# EAGLE design 408_jetracer_ledappend_board (EAGLE 9.6.2)
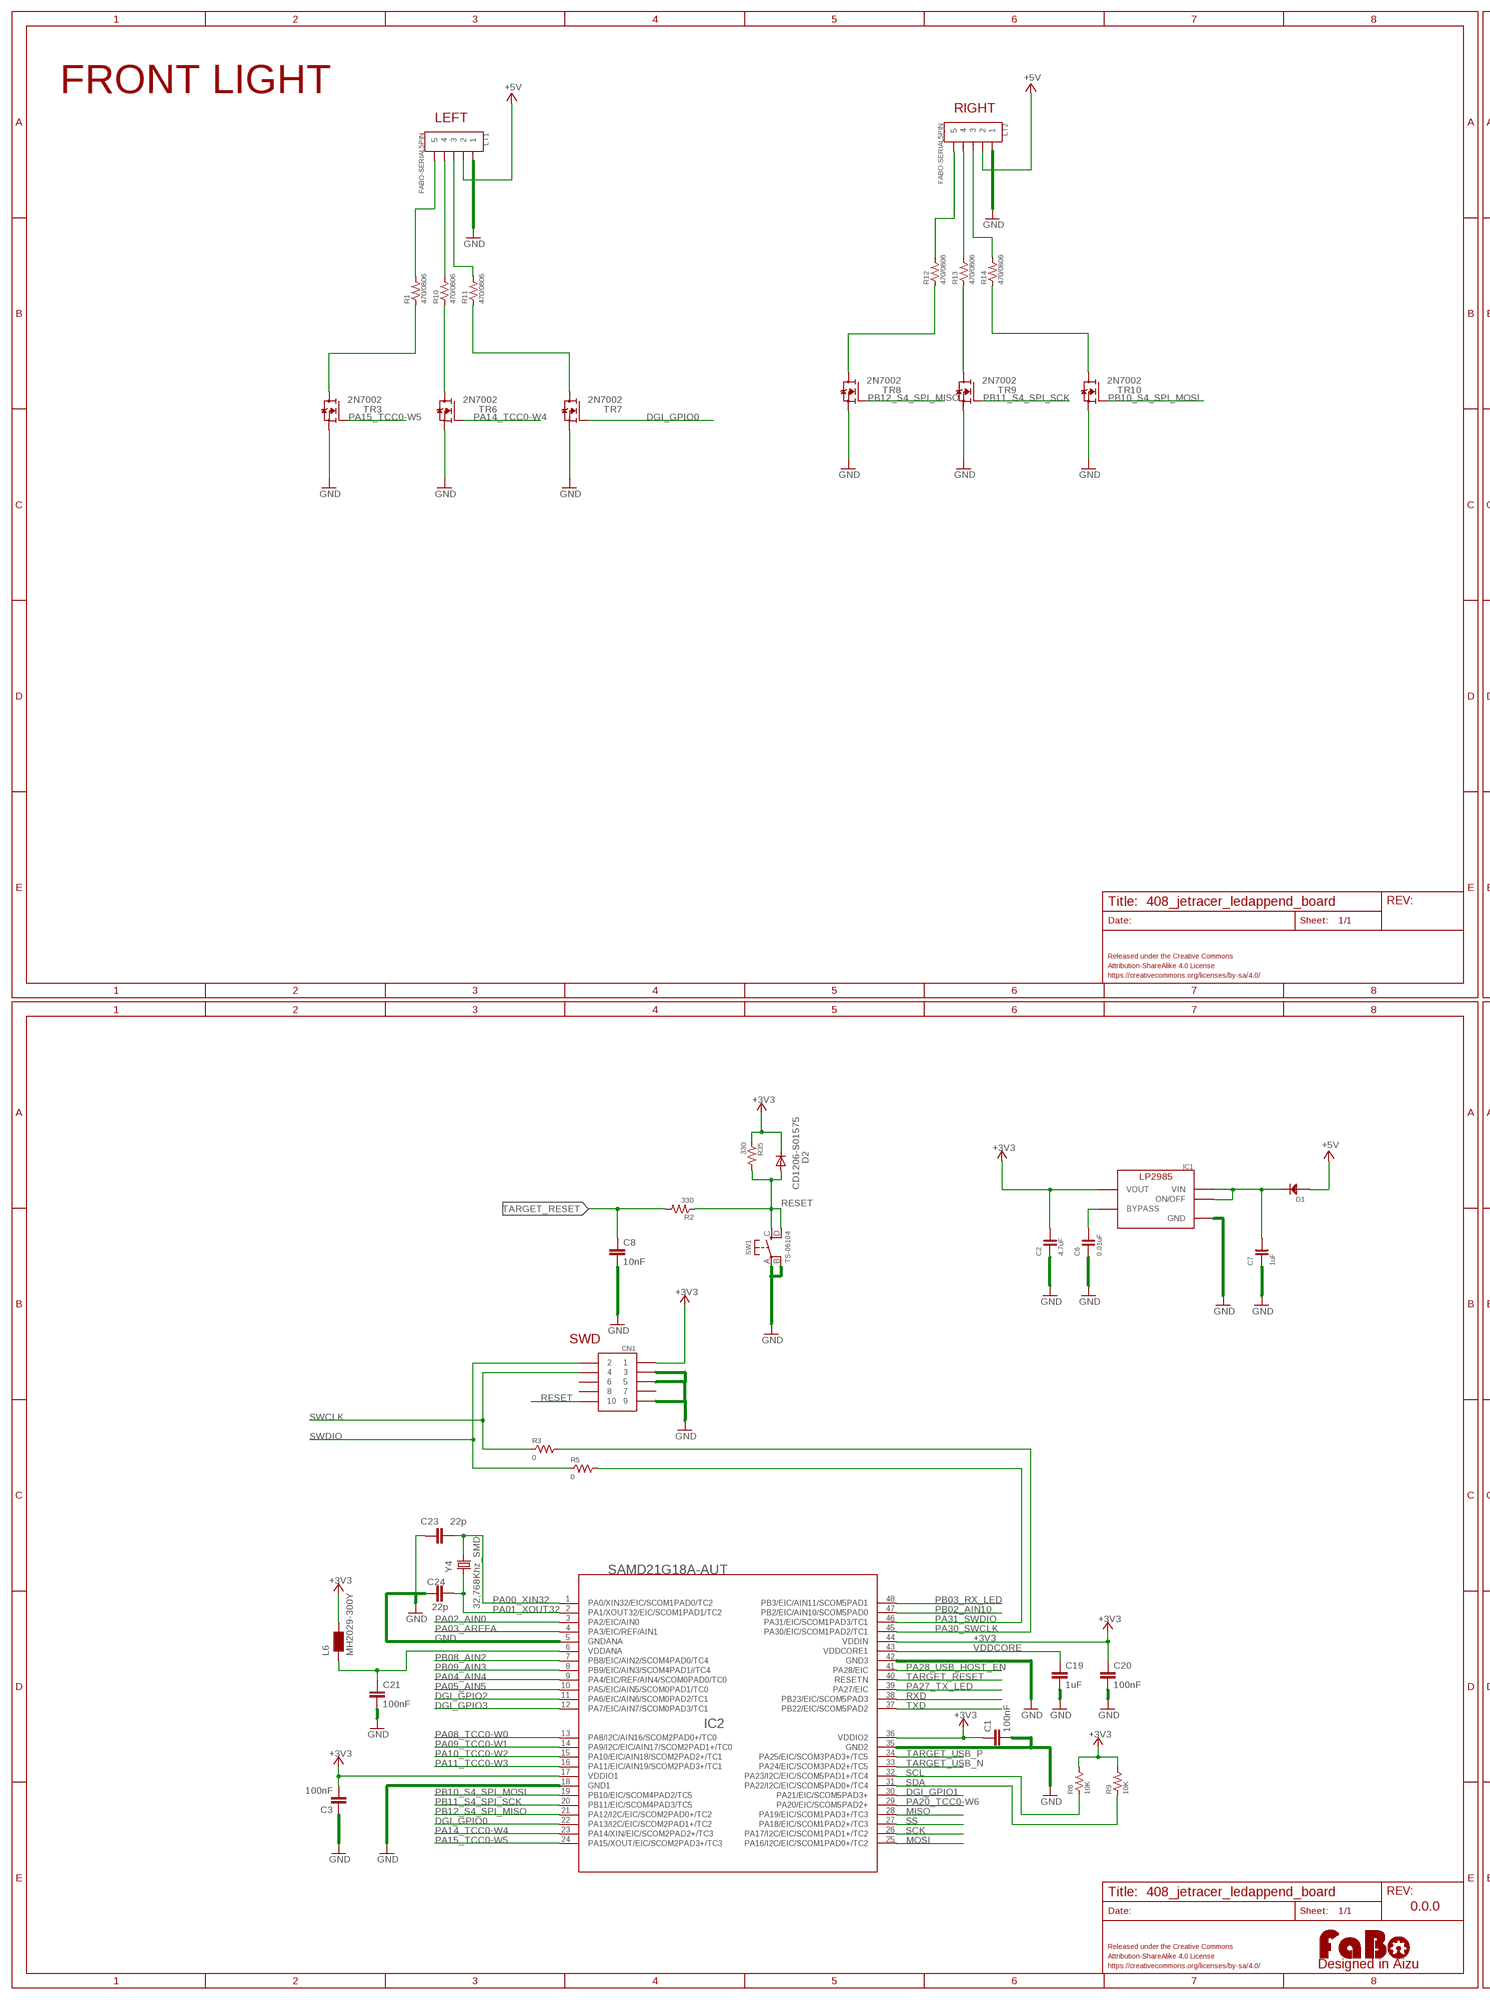
[diagram p0: schematic, sheet 1, part 1 of 2]
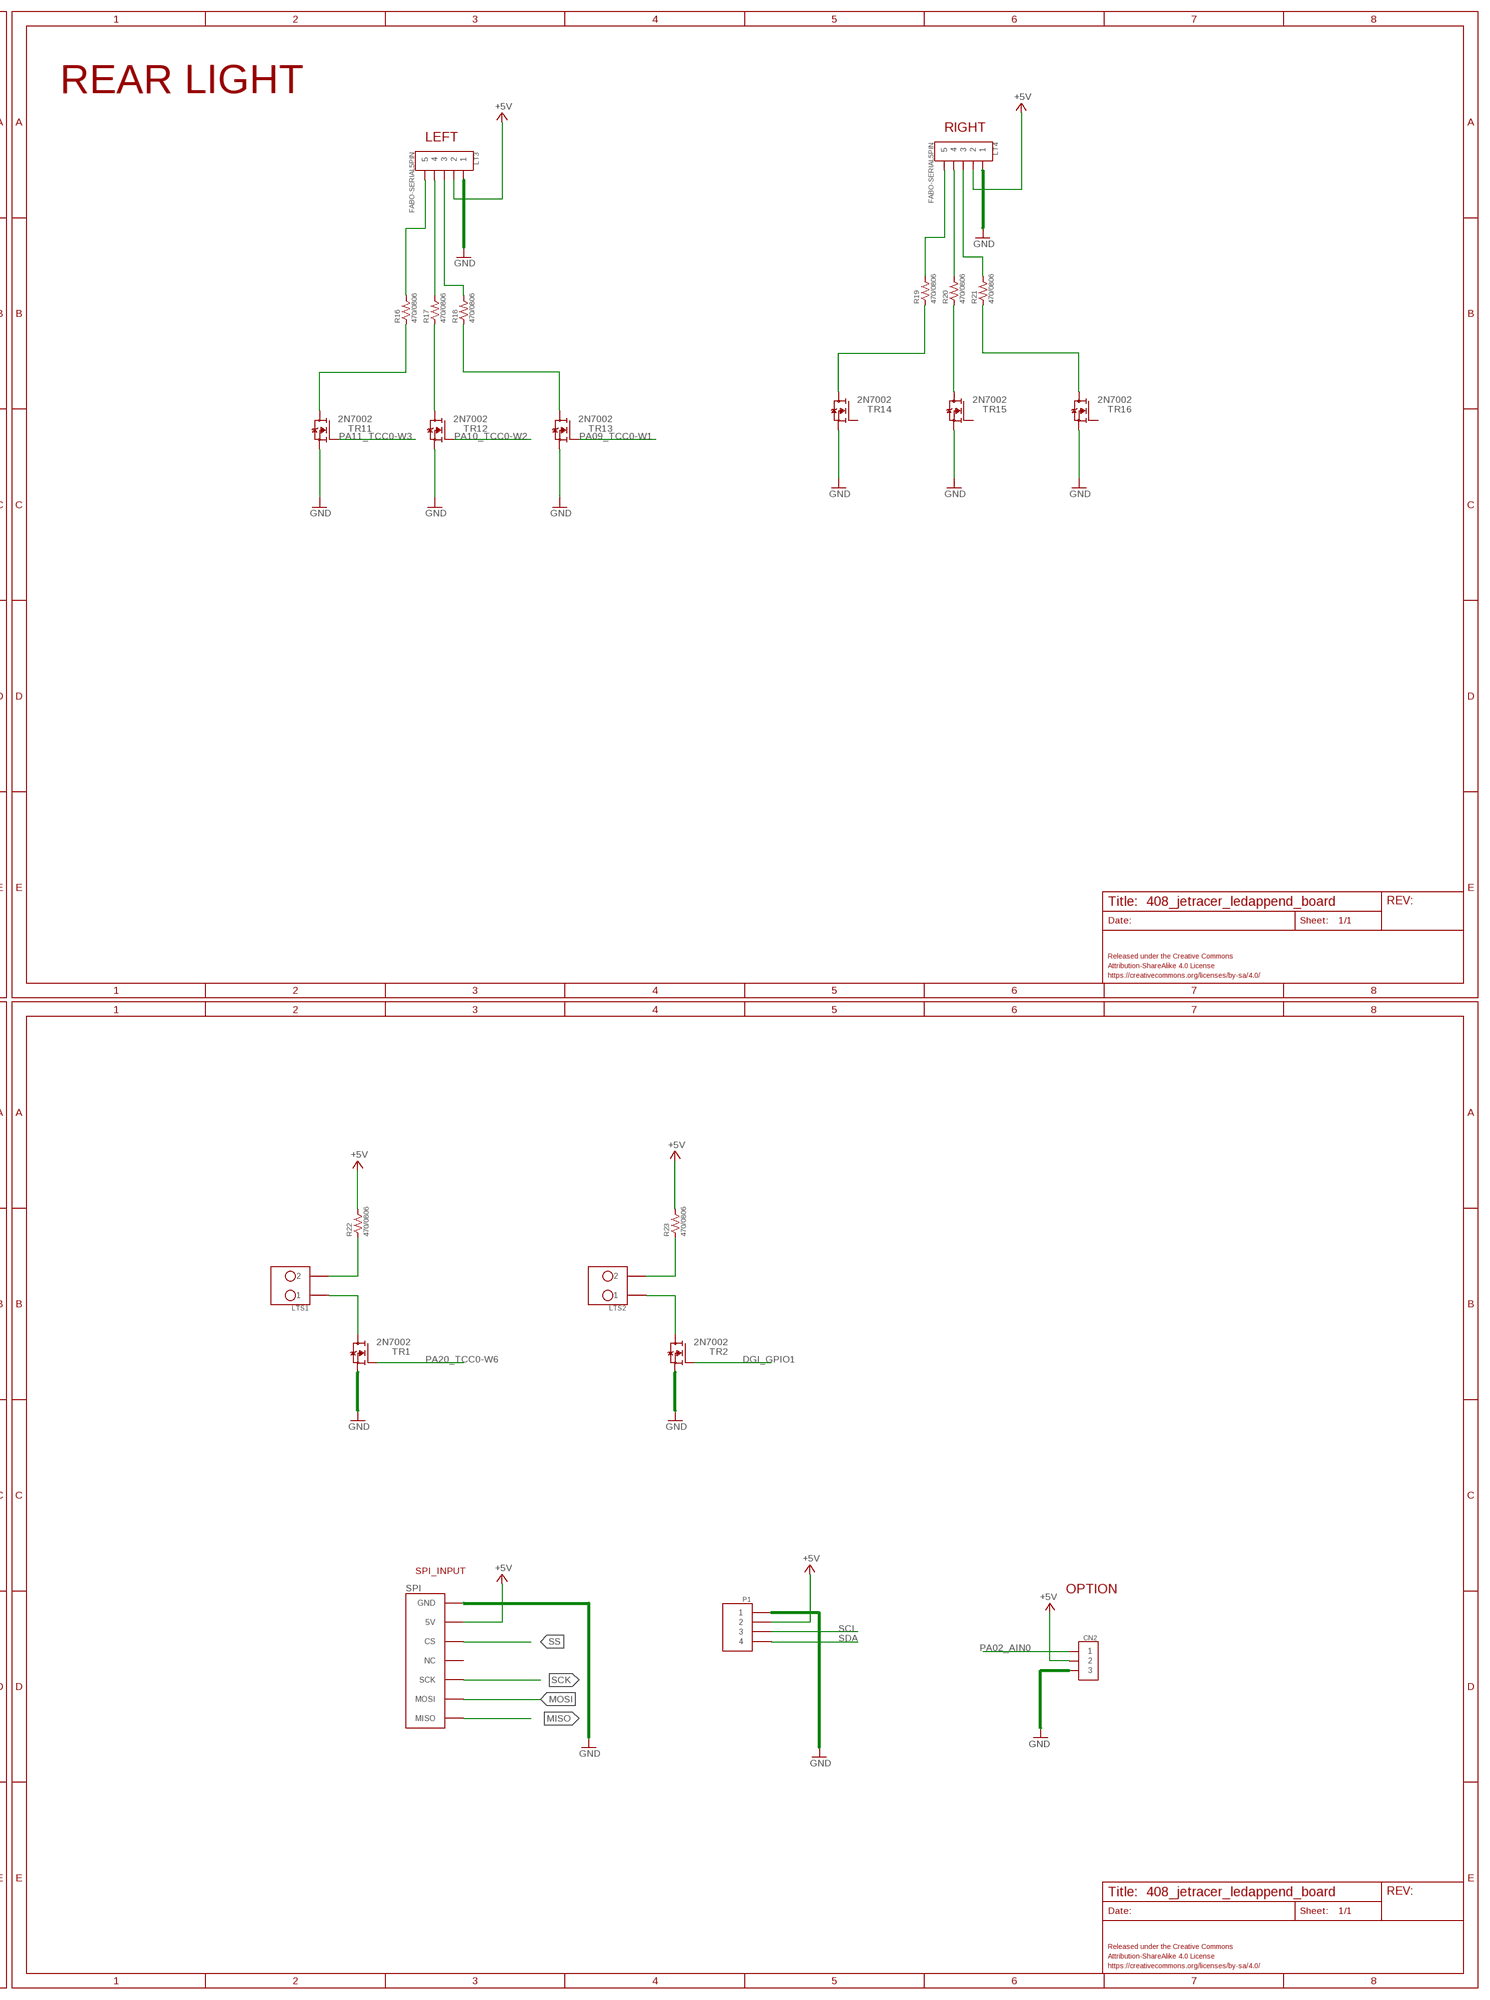
[diagram p1: schematic, sheet 1, part 2 of 2]

## Parts
C1  100nF  0015_100NF_0603  [C0603-ROUND]
C2  4.7uF  CAPACITOR-0603  [0603]
C3  100nF  0015_100NF_0603  [C0603-ROUND]
C6  0.01uF  CAPACITOR-0603  [0603]
C7  1uF  CAPACITOR-0603  [0603]
C8  10nF  0142_10NF_0603  [C0603-ROUND]
C19  1uF  0006_1UF_0603/GRM188R61E105KA12D  [C0603-ROUND]
C20  100nF  0015_100NF_0603  [C0603-ROUND]
C21  100nF  0015_100NF_0603  [C0603-ROUND]
C23  22p  0014_22PF_0603  [C0603-ROUND]
C24  22p  0014_22PF_0603  [C0603-ROUND]
CN1  PIN-HEADER-SMT(1.27MM)2X5  [PIN-HEADER-SMT(1.27MM)2X5]
CN2  PIN_1X3  [PIN_1X3]
D1  DIODE-SOD-323  [SOD-323]
D2  CD1206-S01575  0012_CD1206-S01575  [MINIMELF]
IC1  LP2985-33DBV  [SOT-23-5]
IC2  SAMD21G18A-AUT  1792_SAMD21G18A-AUT  [TQFP48-7X7]
L6  MH2029-300Y  0001_BLM21PG300SN1D_/_MH2029-300Y  [0805]
LOGO2  LOGO_FABO-M_BOTTOM  [LOGO_FABO_M_BOTTOM]
LT1  FABO-SERIAL5PIN  [BM05B-PASS-1]
LT2  FABO-SERIAL5PIN  [BM05B-PASS-1]
LT3  FABO-SERIAL5PIN  [BM05B-PASS-1]
LT4  FABO-SERIAL5PIN  [BM05B-PASS-1]
LTS1  B2B-XH-AM  [B2B-XH-AM]
LTS2  B2B-XH-AM  [B2B-XH-AM]
P1  4PIN_HEADER_1.25MM  [4PIN_1.25MM]
R1  470/0806  RESISTOR-0805  [0805]
R2  330  RESISTOR-0603  [0603]
R3  0  RESISTOR-0603  [0603]
R5  0  RESISTOR-0603  [0603]
R8  10K  RESISTOR-0603  [0603]
R9  10K  RESISTOR-0603  [0603]
R10  470/0806  RESISTOR-0805  [0805]
R11  470/0806  RESISTOR-0805  [0805]
R12  470/0806  RESISTOR-0805  [0805]
R13  470/0806  RESISTOR-0805  [0805]
R14  470/0806  RESISTOR-0805  [0805]
R16  470/0806  RESISTOR-0805  [0805]
R17  470/0806  RESISTOR-0805  [0805]
R18  470/0806  RESISTOR-0805  [0805]
R19  470/0806  RESISTOR-0805  [0805]
R20  470/0806  RESISTOR-0805  [0805]
R21  470/0806  RESISTOR-0805  [0805]
R22  470/0806  RESISTOR-0805  [0805]
R23  470/0806  RESISTOR-0805  [0805]
R35  330  RESISTOR-0603  [0603]
SPI  FABO-7PINMULTI_SPI  [BM07B-PASS-1]
SW1  TS-06104  [TS-06104]
TR1  2N7002  1612_2N7002LT1G  [SOT-23]
TR2  2N7002  1612_2N7002LT1G  [SOT-23]
TR3  2N7002  1612_2N7002LT1G  [SOT-23]
TR6  2N7002  1612_2N7002LT1G  [SOT-23]
TR7  2N7002  1612_2N7002LT1G  [SOT-23]
TR8  2N7002  1612_2N7002LT1G  [SOT-23]
TR9  2N7002  1612_2N7002LT1G  [SOT-23]
TR10  2N7002  1612_2N7002LT1G  [SOT-23]
TR11  2N7002  1612_2N7002LT1G  [SOT-23]
TR12  2N7002  1612_2N7002LT1G  [SOT-23]
TR13  2N7002  1612_2N7002LT1G  [SOT-23]
TR14  2N7002  1612_2N7002LT1G  [SOT-23]
TR15  2N7002  1612_2N7002LT1G  [SOT-23]
TR16  2N7002  1612_2N7002LT1G  [SOT-23]
Y4  32,768Khz_SMD  0213_ABS07-32.768KHZ-T  [RESONATOR_EPSON_FC_145]

## Nets
+3V3: C1.1 C2.2 C3.2 C20.1 CN1.1 D2.C IC1.5(VOUT) IC2.17(VDDIO1) IC2.36(VDDIO2) IC2.44(VDDIN) L6.2 R8.2 R9.2 R35.1
+5V [usbvcc]: CN2.2 D1.A(ANODE) LT1.2 LT2.2 LT3.2 LT4.2 P1.2 R22.2 R23.2 SPI.2(5V)
DGI_GPIO0: IC2.22(PA13/I2C/EIC/SCOM2PAD1+/TC2) TR7.3(G)
DGI_GPIO1: IC2.30(PA21/EIC/SCOM5PAD3+) TR2.3(G)
DGI_GPIO2: IC2.11(PA6/EIC/AIN6/SCOM0PAD2/TC1)
DGI_GPIO3: IC2.12(PA7/EIC/AIN7/SCOM0PAD3/TC1)
GND [gnd]: C1.2 C2.1 C3.1 C6.1 C7.1 C8.2 C19.2 C20.2 C21.2 C23.1 C24.1 CN1.3 CN1.5 CN1.9 CN2.3 IC1.2(GND) IC2.5(GNDANA) IC2.18(GND1) IC2.35(GND2) IC2.42(GND3) LT1.1 LT2.1 LT3.1 LT4.1 P1.1 SPI.1(GND) SW1.A SW1.B TR1.2(S) TR2.2(S) TR3.2(S) TR6.2(S) TR7.2(S) TR8.2(S) TR9.2(S) TR10.2(S) TR11.2(S) TR12.2(S) TR13.2(S) TR14.2(S) TR15.2(S) TR16.2(S)
MISO: IC2.28(PA19/EIC/SCOM1PAD3+/TC3) SPI.7(MISO)
MOSI: IC2.25(PA16/I2C/EIC/SCOM1PAD0+/TC2) SPI.6(MOSI)
N$1: R13.1 TR9.1(D)
N$2: R10.1 TR6.1(D)
N$3: R1.1 TR3.1(D)
N$5: R11.1 TR7.1(D)
N$6: LT1.5 R1.2
N$7: C6.2 IC1.4(BYPASS)
N$8: R12.1 TR8.1(D)
N$9: LT1.4 R10.2
N$10: C21.1 IC2.6(VDDANA) L6.1
N$11: LT1.3 R11.2
N$12: LT2.5 R12.2
N$13: LT2.4 R13.2
N$14: LT2.3 R14.2
N$15: R14.1 TR10.1(D)
N$16: R17.1 TR12.1(D)
N$17: R16.1 TR11.1(D)
N$18 [usbvcc]: LTS1.2 R22.1
N$19 [usbvcc]: LTS2.2 R23.1
N$20: LT3.5 R16.2
N$21: LT3.4 R17.2
N$22: LT3.3 R18.2
N$23: LT4.5 R19.2
N$24: LT4.4 R20.2
N$25: LT4.3 R21.2
N$26: R18.1 TR13.1(D)
N$27: R20.1 TR15.1(D)
N$28: R19.1 TR14.1(D)
N$31: R21.1 TR16.1(D)
N$32 [usbvcc]: C7.2 D1.K(CATHODE) IC1.1(VIN) IC1.3(ON/OFF)
N$33: LTS1.1 TR1.1(D)
N$34: LTS2.1 TR2.1(D)
PA00_XIN32: C23.2 IC2.1(PA0/XIN32/EIC/SCOM1PAD0/TC2) Y4.P$2
PA01_XOUT32: C24.2 IC2.2(PA1/XOUT32/EIC/SCOM1PAD1/TC2) Y4.P$1
PA02_AIN0: CN2.1 IC2.3(PA2/EIC/AIN0)
PA03_AREFA: IC2.4(PA3/EIC/REF/AIN1)
PA04_AIN4: IC2.9(PA4/EIC/REF/AIN4/SCOM0PAD0/TC0)
PA05_AIN5: IC2.10(PA5/EIC/AIN5/SCOM0PAD1/TC0)
PA08_TCC0-W0: IC2.13(PA8/I2C/AIN16/SCOM2PAD0+/TC0)
PA09_TCC0-W1: IC2.14(PA9/I2C/EIC/AIN17/SCOM2PAD1+/TC0) TR13.3(G)
PA10_TCC0-W2: IC2.15(PA10/EIC/AIN18/SCOM2PAD2+/TC1) TR12.3(G)
PA11_TCC0-W3: IC2.16(PA11/EIC/AIN19/SCOM2PAD3+/TC1) TR11.3(G)
PA14_TCC0-W4: IC2.23(PA14/XIN/EIC/SCOM2PAD2+/TC3) TR6.3(G)
PA15_TCC0-W5: IC2.24(PA15/XOUT/EIC/SCOM2PAD3+/TC3) TR3.3(G)
PA20_TCC0-W6: IC2.29(PA20/EIC/SCOM5PAD2+) TR1.3(G)
PA27_TX_LED: IC2.39(PA27/EIC)
PA28_USB_HOST_EN: IC2.41(PA28/EIC)
PA30_SWCLK: IC2.45(PA30/EIC/SCOM1PAD2/TC1) R3.2
PA31_SWDIO: IC2.46(PA31/EIC/SCOM1PAD3/TC1) R5.2
PB02_AIN10: IC2.47(PB2/EIC/AIN10/SCOM5PAD0)
PB03_RX_LED: IC2.48(PB3/EIC/AIN11/SCOM5PAD1)
PB08_AIN2: IC2.7(PB8/EIC/AIN2/SCOM4PAD0/TC4)
PB09_AIN3: IC2.8(PB9/EIC/AIN3/SCOM4PAD1//TC4)
PB10_S4_SPI_MOSI: IC2.19(PB10/EIC/SCOM4PAD2/TC5) TR10.3(G)
PB11_S4_SPI_SCK: IC2.20(PB11/EIC/SCOM4PAD3/TC5) TR9.3(G)
PB12_S4_SPI_MISO: IC2.21(PA12/I2C/EIC/SCOM2PAD0+/TC2) TR8.3(G)
RESET: CN1.10 D2.A R2.1 R35.2 SW1.C SW1.D
RXD: IC2.38(PB23/EIC/SCOM5PAD3)
SCK: IC2.26(PA17/I2C/EIC/SCOM1PAD1+/TC2) SPI.5(SCK)
SCL: IC2.32(PA23/I2C/EIC/SCOM5PAD1+/TC4) P1.3 R8.1
SDA: IC2.31(PA22/I2C/EIC/SCOM5PAD0+/TC4) P1.4 R9.1
SS: IC2.27(PA18/EIC/SCOM1PAD2+/TC3) SPI.3(CS)
SWCLK: CN1.4 R3.1
SWDIO: CN1.2 R5.1
TARGET_RESET: C8.1 IC2.40(RESETN) R2.2
TARGET_USB_N [USBpair]: IC2.33(PA24/EIC/SCOM3PAD2+/TC5)
TARGET_USB_P [USBpair]: IC2.34(PA25/EIC/SCOM3PAD3+/TC5)
TXD: IC2.37(PB22/EIC/SCOM5PAD2)
VDDCORE: C19.1 IC2.43(VDDCORE1)
Unconnected: CN1.6 CN1.7 CN1.8 SPI.4(NC) TR14.3(G) TR15.3(G) TR16.3(G)

## Notes on the sheet
- FRONT LIGHT | REAR LIGHT
- RIGHT
- LEFT
- RIGHT
- LEFT
- SWD
- SPI_INPUT
- OPTION
- 0.0.0

## Library data of the parts
C1 C3 C20 C21 = Condensatori:0015_100NF_0603: 100nF 0603 50V; CASE: 0603; MONTHLY_USAGE: _____; PART_NUMBER: cl10b104kbnc; PRICE: _____; SUPPLIER: _____; TYPE: Condensatori
C2 C6 C7 = FaBo-Capacitor:CAPACITOR: CAPACITOR
C8 = Condensatori:0142_10NF_0603: 10nF 0603; CASE: 0603; MONTHLY_USAGE: _____; PART_NUMBER: 10nF_0603; PRICE: _____; SUPPLIER: _____; TYPE: Condensatori
C19 = Condensatori:0006_1UF_0603/GRM188R61E105KA12D: 1uF 0603; CASE: 0603; MONTHLY_USAGE: _____; PART_NUMBER: 1uF_0603/GRM188R61E105KA12D; PRICE: _____; SUPPLIER: _____; TYPE: Condensatori
C23 C24 = Condensatori:0014_22PF_0603: 22pF 0603; CASE: 0603; MONTHLY_USAGE: _____; PART_NUMBER: 22pF_0603; PRICE: _____; SUPPLIER: _____; TYPE: Condensatori
CN1 = FaBo-PIN:PIN-HEADER-SMT(1.27MM)2X5
CN2 = FaBo-PIN:PIN_1X3
D1 = FaBo-Diode:DIODE
D2 = Diodi:0012_CD1206-S01575: small-signal high-speed Switching Diodes CD1206; CASE: 1206; MONTHLY_USAGE: _____; PART_NUMBER: CD1206-S01575; PRICE: _____; SUPPLIER: _____; TYPE: Diodi
IC1 = FaBo-Supply:LP2985: LP2985
IC2 = IntegratedCircuits:1792_SAMD21G18A-AUT: Atmel D21 32bit ARM Cortex-M0 microcontroller - 48 PIN TQFP 256KB flash memory + 32KB SRAM
L6 = Protezione:0001_BLM21PG300SN1D_/_MH2029-300Y: BLM21; MONTHLY_USAGE: _____; PART_NUMBER: BLM21PG300SN1D_/_MH2029-300Y; PRICE: _____; SUPPLIER: _____; TYPE: Protezione
LOGO2 = FaBo-Logo:LOGO_FABO
LT1-LT4 = FaBo-Connetor:FABO-SERIAL5PIN
LTS1 LTS2 = FaBo-Connetor:B2B-XH-AM
P1 = FaBo-Connetor:4PIN_HEADER_1.25MM
R1-R3 R5 R8-R14 R16-R23 R35 = FaBo-Resistors:RESISTOR: RESISTOR
SPI = FaBo-Connetor:FABO-7PINMULTI_SPI
SW1 = FaBo-Switch:TS-06104
TR1-TR3 TR6-TR16 = Transistors:1612_2N7002LT1G: 2N7002 60 V, 300 mA N-channel Trench MOSFET
Y4 = Cristalli:0213_ABS07-32.768KHZ-T: 32,768KHz - SMD; MONTHLY_USAGE: _____; PART_NUMBER: ABS07-32.768KHZ-T; PRICE: _____; SUPPLIER: _____; TYPE: Cristalli

## Net classes
0 default: width 0.203 mm, drill 0.406 mm, clearance 0.203 mm
1 USB: width 0.203 mm, drill 0.305 mm, clearance 0.178 mm
2 gnd: width 0.254 mm, drill 0.254 mm, clearance 0.178 mm
3 usbvcc: width 0.203 mm, drill 0.406 mm, clearance 0.178 mm
4 USBpair: width 0.254 mm, drill 0.406 mm, clearance 0.406 mm

## Board
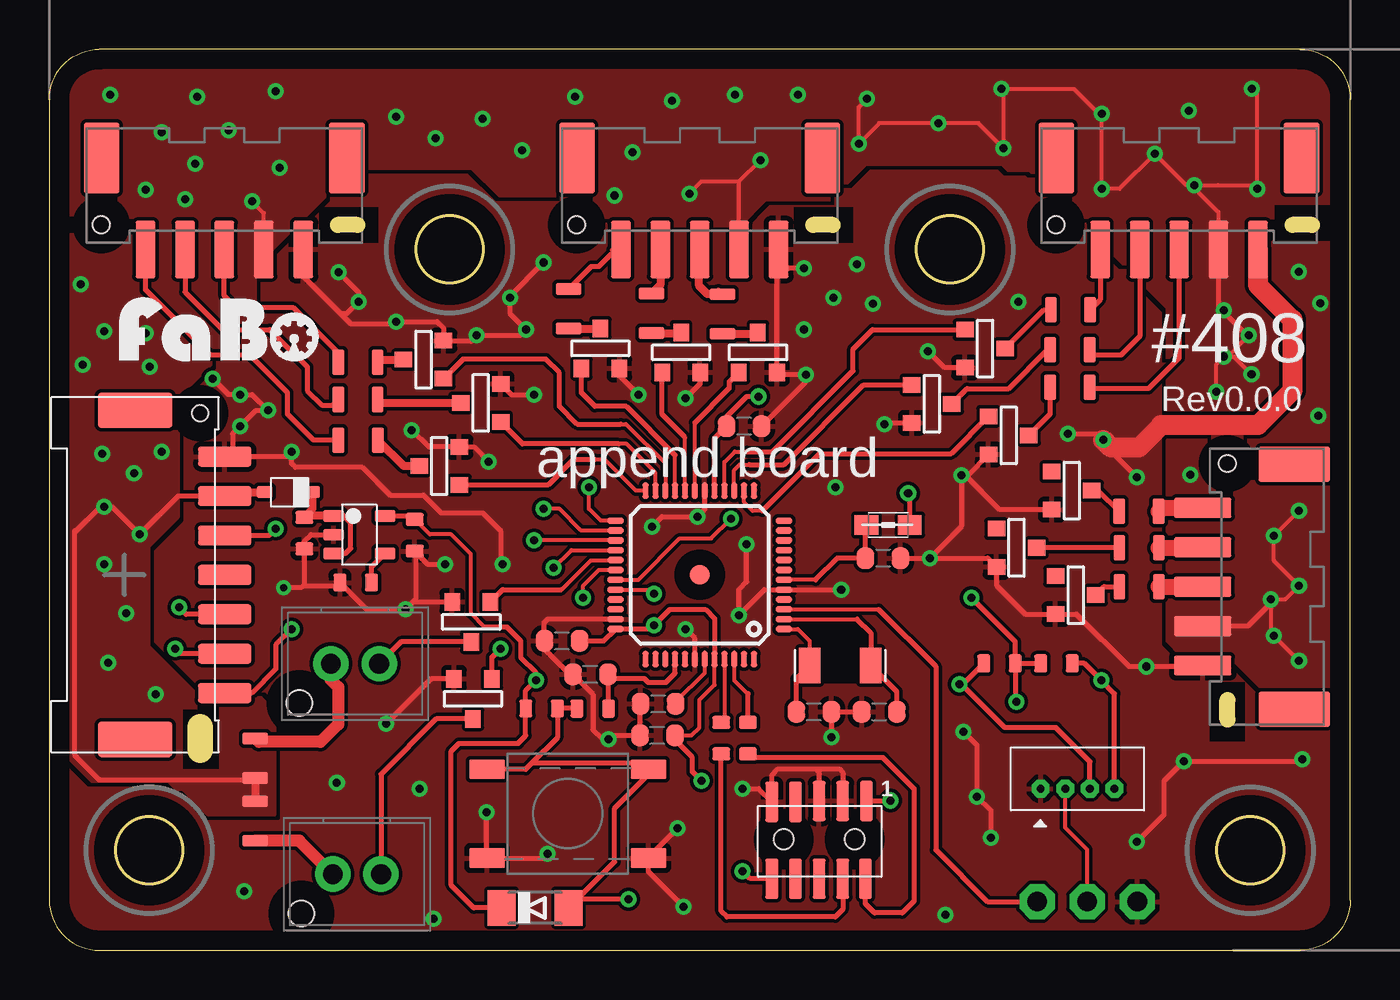
[diagram p2: board, top side]
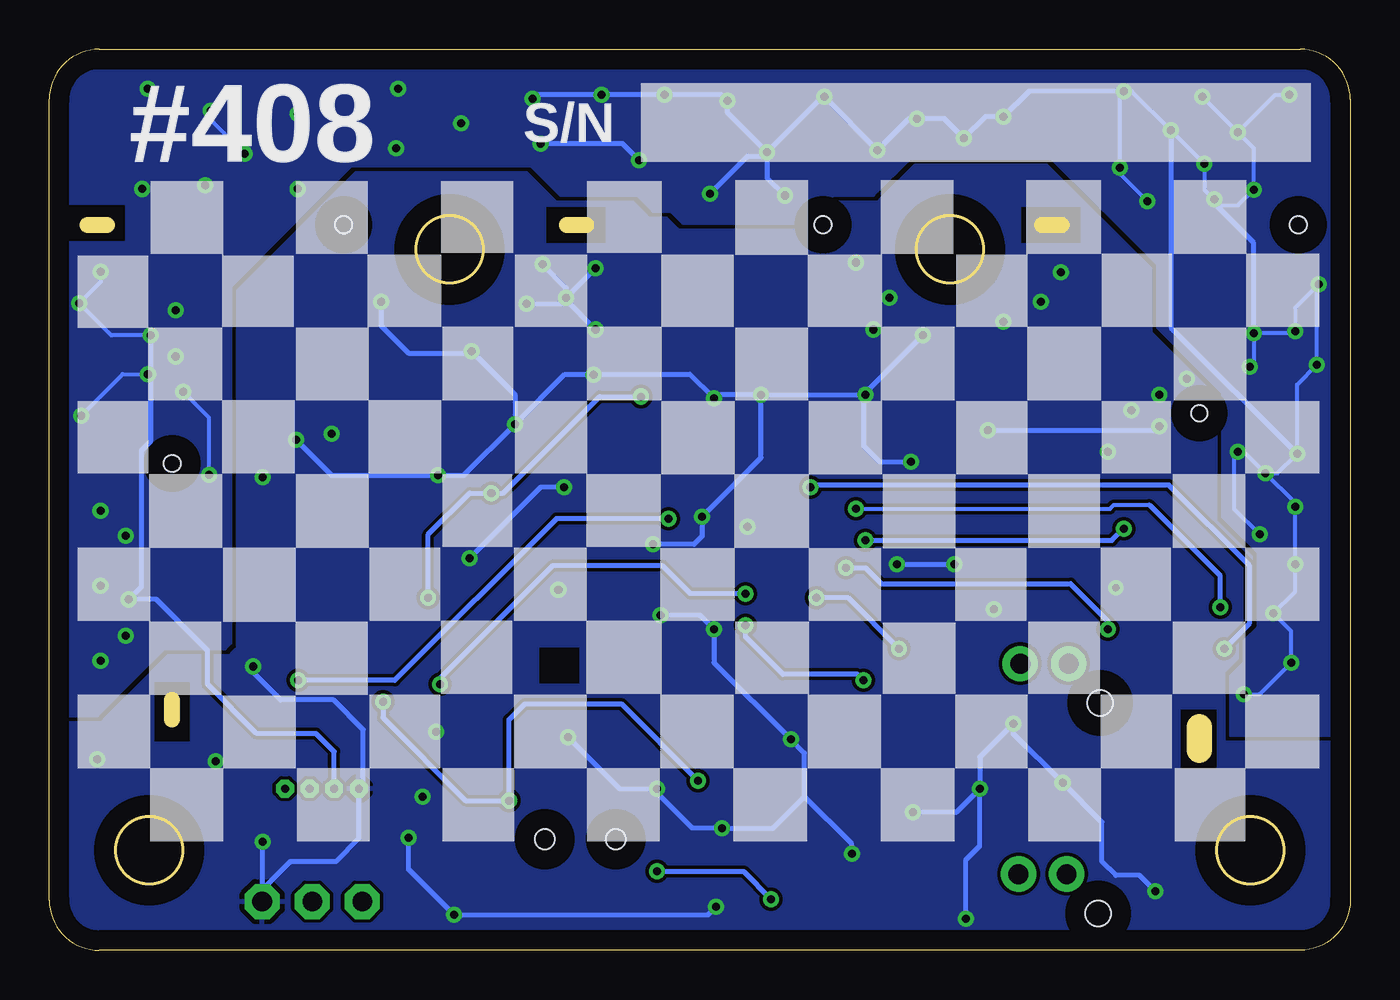
[diagram p3: board, bottom side, seen from below]

Size 66.04 x 45.72 mm. Coordinates in mm from the lower left corner, seen from the top.
Outline: 2.54,0 63.5,0 arc90 66.04,2.54 66.04,43.18 arc90 63.5,45.72 2.54,45.72 arc90 0,43.18 0,2.54 arc90 2.54,0
Outline: circle at 5.08,5.08 radius 1.7
Outline: circle at 20.32,35.56 radius 1.7
Outline: circle at 60.96,5.08 radius 1.7
Outline: circle at 45.72,35.56 radius 1.7
Copper layers (1*16): Top 0.035mm / dielectric 1.5mm / Bottom 0.035mm
Design rules "default *": minimum track width 6mil, minimum drill 0.35mm, track to track 6mil, track to pad 6mil, pad to pad 6mil, via to via 6mil, smd to smd 6mil, copper to edge 40mil, drill to drill 6mil, minimum pad ring 10mil, minimum via ring 8mil, stop-mask expansion 4mil, vias tented up to drill 0.6mm, thermal gap 10mil
tRestrict: area 6.8,9.2 to 8.6,12.2; area 58.9,10.6 to 60.7,13.6; area 62.2,36 to 65.2,37.8; area 37.8,35.9 to 40.8,37.7; area 13.7,35.9 to 16.7,37.7
bRestrict: area 6.8,9.2 to 8.6,12.2; area 58.9,10.6 to 60.7,13.6; area 13.7,35.9 to 16.7,37.7; area 37.8,35.9 to 40.8,37.7; area 62.2,36 to 65.2,37.8

### Footprints (pad centres in the part's own frame; a part is rotated, then mirrored left to right if it is on the bottom)
C0603-ROUND = smd 0.898 x 1.1: 1 -0.889,0; 2 0.889,0
0603 = smd 0.65 x 0.9: 1 -0.8,0; 2 0.8,0
PIN-HEADER-SMT(1.27MM)2X5 = smd 0.635 x 2.032: 1 -2.4,-1.95; 2 -2.35,2; 3 -1.2,-1.95; 4 -1.2,2; 5 0,-1.95; 6 0,2; 7 1.2,-1.9; 8 1.2,2; 9 2.4,-1.9; 10 2.4,2 | hole 1: 1.8,0; -1.8,0
PIN_1X3 = drill 1 pad 1.778 octagon: 1 -2.54,0; 2 0,0; 3 2.54,0
SOD-323 = smd 0.8 x 0.6: A -1.2,0; K 1.2,0
MINIMELF = smd 1.4 x 1.8: A 1.7,0; C -1.7,0
SOT-23-5 = smd 0.6 x 1.05: 1 -0.95,-1.3; 2 0,-1.3; 3 0.95,-1.3; 4 0.95,1.3; 5 -0.95,1.3
TQFP48-7X7 = smd 0.85 x 0.32: 1 -4.275,2.75; 2 -4.275,2.25; 3 -4.275,1.75; 4 -4.275,1.25; 5 -4.275,0.75; 6 -4.275,0.25; 7 -4.275,-0.25; 8 -4.275,-0.75; 9 -4.275,-1.25; 10 -4.275,-1.75; 11 -4.275,-2.25; 12 -4.275,-2.75; 25 4.275,-2.75; 26 4.275,-2.25; 27 4.275,-1.75; 28 4.275,-1.25; 29 4.275,-0.75; 30 4.275,-0.25; 31 4.275,0.25; 32 4.275,0.75; 33 4.275,1.25; 34 4.275,1.75; 35 4.275,2.25; 36 4.275,2.75 | smd 0.32 x 0.85: 13 -2.75,-4.275; 14 -2.25,-4.275; 15 -1.75,-4.275; 16 -1.25,-4.275; 17 -0.75,-4.275; 18 -0.25,-4.275; 19 0.25,-4.275; 20 0.75,-4.275; 21 1.25,-4.275; 22 1.75,-4.275; 23 2.25,-4.275; 24 2.75,-4.275; 37 2.75,4.275; 38 2.25,4.275; 39 1.75,4.275; 40 1.25,4.275; 41 0.75,4.275; 42 0.25,4.275; 43 -0.25,4.275; 44 -0.75,4.275; 45 -1.25,4.275; 46 -1.75,4.275; 47 -2.25,4.275; 48 -2.75,4.275 | smd 1 x 1: P$1 0,0
0805 = smd 1.2 x 1: 1 -1.1,0; 2 1.1,0
BM05B-PASS-1 = smd 1 x 2.9: 1 -4,0; 2 -2,0; 3 0,0; 4 2,0; 5 4,0 | smd 1.8 x 3.6: 6 6.22,-4.65; 7 -6.22,-4.65 | hole 0.85: 6.25,-1.25
B2B-XH-AM = drill 1 pad 1.8: 1 -1.225,0; 2 1.225,0 | hole 1.3: 2.825,2
4PIN_1.25MM = drill 0.4 octagon: 1 1.875,0; 2 0.625,0; 3 -0.625,0; 4 -1.875,0
0805' = smd 0.6 x 1.3: 1 -1,0; 2 1,0
BM07B-PASS-1 = smd 1 x 2.7: 1 6,-5.1; 2 4,-5.1; 3 2,-5.1; 4 0,-5.1; 5 -2,-5.1; 6 -4,-5.1; 7 -6,-5.1 | smd 1.8 x 3.8: PL 8.35,-0.55; PR -8.35,-0.55 | hole 0.8: 8.2,-3.85
TS-06104 = smd 1.8 x 1: A 4.1,2.25; B -4.1,2.25; C 4.1,-2.25; D -4.1,-2.25
SOT-23 = smd 0.787 x 0.889: 1 0.025,-1.016; 2 -0.94,1.016; 3 0.991,1.016
RESONATOR_EPSON_FC_145 = smd 1.1 x 1.8: P$1 -1.55,0; P$2 1.55,0

### Placement (x,y rotation side)
C1  26.02,15.7 180 top
C2  18.55,21.06 90 top
C3  35.27,26.6 180 top
C6  15.56,18.66 0 top
C7  12.95,21.17 90 top
C8  27.47,14 180 top
C19  30.91,12.5 180 top
C20  30.87,10.9 180 top
C21  42.32,19.9 0 top
C23  38.81,12.1 180 top
C24  42.13,12.1 0 top
CN1  39.08,5.63 180 top
CN2  52.69,2.47 0 top
D1  12.14,23.25 0 top
D2  24.66,2.15 0 top
IC1  15.74,21.09 270 top
IC2  33.02,19.05 180 top
L6  42.58,21.58 0 top
LOGO2  8.62,29.51 0 bottom
LT1  8.89,35.56 180 top
LT2  33.02,35.56 180 top
LT3  57.35,35.56 180 top
LT4  58.55,18.45 90 top
LTS1  15.52,14.54 180 top
LTS2  15.62,3.86 180 top
P1  52.2,8.2 180 top
R1  470/0806  [0805']  15.68,25.89 180 top
R2  27.59,12.26 0 top
R3  34.11,10.77 90 top
R5  35.47,10.77 90 top
R8  48.24,14.56 0 top
R9  51.13,14.56 180 top
R10  470/0806  [0805']  15.67,27.95 180 top
R11  470/0806  [0805']  15.67,29.83 180 top
R12  470/0806  [0805']  26.37,32.55 90 top
R13  470/0806  [0805']  30.57,32.32 90 top
R14  470/0806  [0805']  34.17,32.29 90 top
R16  470/0806  [0805']  51.84,32.5 0 top
R17  470/0806  [0805']  51.81,30.47 0 top
R18  470/0806  [0805']  51.81,28.57 0 top
R19  470/0806  [0805']  55.31,22.27 0 top
R20  470/0806  [0805']  55.32,20.42 0 top
R21  470/0806  [0805']  55.32,18.45 0 top
R22  470/0806  [0805']  10.46,9.74 270 top
R23  470/0806  [0805']  10.46,6.56 90 top
R35  24.99,12.27 0 top
SPI  3.81,19.05 90 top
SW1  26.32,6.93 180 top
TR1  21.4,16.66 0 top
TR2  21.48,12.76 0 top
TR3  19.8,24.6 270 top
TR6  21.9,27.8 270 top
TR7  19,30 270 top
TR8  28,30.54 180 top
TR9  32.1,30.34 180 top
TR10  36,30.34 180 top
TR11  47.5,30.5 90 top
TR12  44.8,27.7 90 top
TR13  48.7,26.1 90 top
TR14  51.9,23.3 90 top
TR15  49.1,20.4 90 top
TR16  52.1,18 90 top
Y4  40.15,14.45 180 top

### Tracks (layer width: path | path; a pad name or v marks a point on that pad's centre or on a via)
+3V3  (via drill 0.41)
  Top 0.203: 22.1,16.4 21.4,17.1 21.4,20.1 20.4,21.1 19.31,21.1 C2.2 | C20.1 32.6,10.9 33,11.3 33,12.7 33.77,13.47 IC2.44
  Top 0.254: C20.1 32,10.9 32,10.44 32.65,9.79 32.65,9.05 v33.1,8.6 | IC2.17 33.77,25.99 C3.2 34.38,27.08 35.4,28.1 v36,28.1 | L6.2 43.68,23.12 v43.6,23.2 | CN1.1 42.68,7.58 v42.7,7.6 | D2.C 21.55,2.15 20.4,3.3 20.4,10.1 20.8,10.5 23.8,10.5 24.19,10.89 R35.1 24.19,13.19 v24.7,13.7 24.7,14.1 23.94,14.86 23.94,15.71 23.24,16.4 22.1,16.4 | IC1.5 18.37,22.04 C2.2 | IC2.44 33.77,16.83 33.3,17.3 31.5,17.3 v30.7,16.5 30.5,16.3 IC2.36 28.14,15.7 C1.1 | R8.2 R9.2 | R8.2 49.04,15.66 v46.8,17.9 | R8.2 49.04,12.66 v49.1,12.6
  Bottom 0.254: v36,28.1 38.1,28.1 43,23.2 v43.6,23.2 44.7,23.2 46.8,21.1 v46.8,17.9 | v33.1,8.6 37,12.5 41.9,12.5 42.7,11.7 v42.7,7.6 44.9,7.6 49.1,11.8 v49.1,12.6 | v24.7,13.7 25,14 28.8,14 30.7,15.9 v30.7,16.5
+5V  (via drill 0.41)
  Top 0.203: CN2.2 52.69,5.11 51.58,6.22 P1.2 | v63.44,14.69 v62.17,15.96 62,16.13 v62,17.8 62.74,17.8 v63.44,18.5 62.17,19.77 v62.17,21.04 v63.44,22.31 | v59.23,28.33 59.23,29.73 v59.63,30.13 | v59.63,30.13 60.13,30.13 v61.03,29.23 | v59.63,30.13 59.83,30.13 60.85,31.15 v60.9,31.2 | 58.3,38.83 v58.12,38.83 57.72,38.83 v56.12,40.43 54.32,38.63 v53.42,38.63 53.42,42.3 | 58.3,38.83 59.32,38.83 | 59.32,38.83 59.35,38.8 | 59.32,38.83 61.12,38.83 v61.32,38.63 61.32,43.43 v61.04,43.71 | 53.42,42.3 v53.42,42.44 | 53.42,42.3 52.01,43.71 v48.34,43.71 48.44,43.61 v48.44,40.7 47.17,41.97 v45.13,41.97 42.13,41.97 v41.09,40.93 41.09,42.79 v41.5,43.2 | LT3.2 59.35,37.45 58.3,38.5 58.3,38.83 | LT1.2 10.89,37.41 v10.3,38 | LT2.2 35.02,39.02 | 35.02,39.02 v36.1,40.1 | v32.5,38.4 33.12,39.02 35.02,39.02
  Top 0.254: R22.2 10.36,8.64 2.56,8.64 1.3,9.9 1.3,21.2 | 1.3,21.2 1.3,21.3 | 8.86,23.1 SPI.2 6.55,23.05 v4.6,21.1 3.2,22.5 v2.8,22.5 2.6,22.5 1.3,21.2 | v62,17.8 62,17.6 60.85,16.45 LT4.2 | v59.63,32.47 59.35,32.75 LT3.2 59.35,32.65 60.85,31.15
  Top 0.406: SPI.2 9.11,23.25 D1.A | R22.2 R23.2
  Bottom 0.203: v5.4,13 4.6,13 v3,14.6 3,16.2 v3.9,17.1 2.8,18.2 v2.8,19.6 v2.8,22.5 2.8,22.7 v4.3,24.2 | v4.3,24.2 3.7,24.2 v2.7,25.2 2.7,28.7 v1.7,29.7 1.7,33.7 v1.6,33.8 2.8,32.6 v2.8,31.4 2.9,31.3 v4.9,31.3 4.9,29.8 v5.1,29.6 | v4.3,24.2 5.4,25.3 v5.7,25.3 5.9,25.1 5.9,22.4 v4.6,21.1 | v5.7,41.5 4.9,40.7 v4.9,38.6 5.7,37.8 6.8,37.8 | v5.7,41.5 3.8,43.4 v3.1,43.4 | v7.5,43.3 v5.7,41.5 | 7.1,38.1 v6.9,38.1 7.4,38.6 v7.4,39.9 v9.1,41.6 11.1,43.6 v11.5,43.6 11.7,43.4 v11.7,39.7 11.7,39.4 v10.3,38 | v57.84,42.61 57.84,42.15 v56.12,40.43 | v64.42,27.13 62.32,29.23 v61.03,29.23 | v60.9,31.2 62.89,31.2 v64.52,32.83 63.42,33.93 v63.42,34.43 | v57.93,24.13 57.93,27.03 v59.23,28.33
  Bottom 0.254: v9.1,41.6 9.1,31.6 v2.7,25.2 | v60.9,31.2 60.9,25.82 61.37,25.35 61.37,18.43 v62,17.8 60.6,17.8 58,15.2 58,13.5 55.5,11 52.5,11 51.58,10.07 P1.2 | v11.5,43.6 16.3,43.6 v17.6,42.3 18.5,42.3 v19.6,41.2 20.6,42.2 v22,42.2 22.4,42.2 v24,40.6 v26.7,43.3 26.8,43.3 v29.6,40.5 | v29.6,40.5 29.6,40.3 | 29.6,40.3 29.6,39.2 v28.7,38.3 | v29.6,40.5 31.6,42.5 v31.6,43.1 31.9,43.4 v34.8,43.4 v38,43.4 41.3,43.4 v41.5,43.2 | v32.5,38.4 30.6,40.3 29.6,40.3 | v36.1,40.1 36.93,40.93 v41.09,40.93 | v4.9,31.3 4.9,35.9 6.8,37.8 7.1,38.1
  pour Bottom (no thermals): -2,11.7 -2,46.6 0.5,49.1 65.7,49.1 68.7,46.1 68.7,14.1 66.5,11.9 63.6,11.9 60.2,15.3 57.1,15.3 56.8,15.6 56.8,33.7 50.7,39.8 41.6,39.8 40.1,38.3 36.2,38.3 35.4,37.5 34.5,37.5 33.9,36.9 27.6,36.9 26.2,38.3 24.2,38.3 22.3,40.2 15.2,40.2 9.8,34.8 9.8,31.6 6.5,28.3 6.5,22 4.7,20.2 4.7,16.4 5.4,15.7 5.4,14.6 6.1,13.9 6.1,10.9 -1.2,10.9
  pour Top (no thermals): -2.5,46.1 1,49.6 66.6,49.6 69.5,46.7 69.5,12.4 69.2,12.1 62.8,12.1 59.9,15 57.5,15 56.8,15.7 56.8,16.2 56.8,32.6 56.4,33 49.8,39.6 48.7,39.6 48.4,39.9 41.4,39.9 39.6,38.1 39.5,38.1 36.3,38.1 35,36.8 28.1,36.8 27.3,36.8 25.8,38.3 22.9,38.3 21.5,39.7 15.6,39.7 15.5,39.8 10.5,34.8 10.4,34.8 10.4,32 7.2,28.8 6.5,28.1 6.5,22 5,20.5 5,16.5 5,15.4 6.3,14.1 7.3,13.1 10.4,13.1 11.4,12.1 11.4,6.9 8.1,6.9 7.7,7.3 6.8,8.2 6.5,8.2 6.1,8.6 2.2,8.6 -2.5,13.3
DGI_GPIO0
  Top 0.203: 29,26.7 29.27,26.7 31.27,24.7 IC2.22
  Top 0.254: 29,26.7 26.8,26.7 25.9,27.6 25.9,29.3 25.2,30 21.01,30 TR7.3
DGI_GPIO1  (via drill 0.41)
  Top 0.203: v27.1,17.88 27.1,18.5 27.9,19.3 IC2.30
  Top 0.254: TR2.3 22.47,14.87 v22.9,15.3
  Bottom 0.254: v22.9,15.3 25.48,17.88 v27.1,17.88
GND  (via drill 0.35, 0.41)
  Top 0.254: 8.96,25.1 SPI.1 9.3,25.05 | C24.1 C23.1 v39.7,10.8 | C7.1 13.07,20.37 | LT1.1 12.89,34.21 14.8,32.3 | 14.8,32.3 15.3,31.8 17.5,31.8 v17.6,31.9 19.7,31.9 20.02,31.58 TR7.2 20.02,30.9 21.4,30.9 v21.7,31.2 23.9,31.2 v24.2,31.5 23.4,32.3 v23.4,33.1 23.4,33.2 v25.1,34.9 | TR6.2 23.46,28.2 v24.6,28.2 | v22.3,24.8 21.56,25.54 TR3.2 19.26,25.54 v18.4,26.4 | C19.2 29.98,12.46 C20.2 28.6,10.9 v28.4,10.7 28.1,10.7 27.6,11.2 27.6,12.98 C8.2 26.4,14 25.13,15.27 C1.2 25.1,15.73 25.1,16.6 25.3,16.8 IC2.35 | v31.9,6.2 30.42,4.72 SW1.B 30.42,3.98 v32.2,2.2 | v35.2,8.2 36.01,8.2 CN1.9 36.68,8.88 37,9.2 38.9,9.2 | CN1.5 39.08,9.02 38.9,9.2 | 38.9,9.2 40.1,9.2 40.28,9.02 CN1.3 | v25.3,4.9 25.08,4.68 SW1.A 22.2,4.7 v22.2,7 | TR10.2 36.94,29.5 | 36.94,29.5 36.94,35.17 | 36.94,35.17 LT2.1 | TR9.2 33.04,28.74 v32.3,28 | 36.94,29.5 37.24,29.2 v38.4,29.2 38.4,28.84 C3.1 | TR8.2 28.94,29.16 v29.9,28.2 | C7.1 12.95,18.5 | 12.95,18.5 12.9,18.5 12.8,18.4 v11.9,18.4 | 12.95,18.5 14.6,18.5 C6.1 16.12,17.3 v18.1,17.3 | 9.3,25.05 9.3,26.2 v9.7,26.6 10.5,27.4 v11.1,27.4 10.3,28.2 v9.7,28.2 9.1,28.2 v8.3,29 | 9.3,25.05 12.05,25.05 v12.3,25.3 12.3,24.7 12.5,24.5 15.9,24.5 17.3,23.1 19,23.1 19.9,22.2 22,22.2 22.9,21.3 22.9,19.7 v23,19.6 | TR13.2 46.62,24.1 46.5,24.1 | 46.5,24.1 v46.3,24.1 46.3,21.5 v44.7,19.9 | v42.4,26.7 42.46,26.76 TR12.2 | TR11.2 45.44,29.56 v44.6,30.4 | C21.2 v44.7,19.9 | v44.7,19.9 47.64,19.9 TR15.2 48.08,18.52 49.54,17.06 TR16.2 52.14,17.06 54.8,14.4 v55.7,14.4 58.5,14.4 LT4.1 | TR14.2 48.24,22.36 46.5,24.1 | IC2.18 33.27,22.37 v32.9,22 31.1,22 v30.6,21.5 | IC2.42 32.77,15.83 v32.3,16.3
  Top 0.254: v35.4,20.6 35.4,18.7 35,18.3 v35,17 36.3,18.3 IC2.5 v40.2,18.3 | v14.7,34.4 15.7,33.4 v15.7,32.9 15.1,32.3 14.8,32.3 | v38.3,34.6 37.51,34.6 36.94,35.17 | v55.2,5.5 56.6,6.9 56.6,8.6 v57.6,9.6 63.5,9.6 v63.6,9.7 | TR2.2 19.38,13.78 v17.1,11.5 | C7.1 12.95,20.75 13.29,21.09 IC1.2 | v18.1,17.3 18.6,17.8 18.6,20.21 C2.1 19.21,19.6 v20.1,19.6 | v18.1,17.3 18.48,17.68 TR1.2 | v51.7,26.2 53.2,26.2 v53.5,25.9 53.5,25.7 v55.2,24 | v46.4,11.1 47.1,10.4 v47.1,7.8 47.8,7.1 v47.8,5.7
  Top 1.016: LT3.1 61.35,33.75 63.1,32 63.1,28.4 61.35,26.65 56.45,26.65 55.3,25.5 53.9,25.5 v53.5,25.9
  Bottom 0.254: 24.7,28.2 v24.6,28.2 v29.9,28.2 | 24.7,28.2 v21.7,31.2 | v39.7,10.8 37.1,8.2 v35.2,8.2 35.2,8 33.4,6.2 v31.9,6.2 29.3,6.2 27.7,7.8 | 27.7,7.8 27.7,10 v28.4,10.7 32.3,14.6 v32.3,16.3 33,17 v35,17 | v25.3,4.9 25.3,5.4 27.7,7.8 | v29.9,28.2 32.1,28.2 v32.3,28 33.54,29.24 38.36,29.24 v38.4,29.2 39.9,29.2 v42.4,26.7 | v18.4,26.4 9.9,26.4 v9.7,26.6 | v42.4,26.7 45,24.1 v46.3,24.1 51.7,24.1 v53.5,25.9 | v44.6,30.4 44.5,30.3 | 44.5,30.3 42.4,28.2 v42.4,26.7 | v35.4,20.6 33.3,20.6 32.9,21 v32.9,22 29.9,25 v29.9,28.2 | v55.7,14.4 55.7,14.1 54.3,12.7 51.6,12.7 50.1,11.2 50.1,8.43 P1.1 50.33,5.67 51.5,4.5 53.8,4.5 55.23,3.07 CN2.3 55.2,2.5 v55.2,5.5 | v38.3,31.5 39.8,33 | 39.8,33 v39.8,33.1 | v39.8,33.1 v38.3,34.6 | v39.8,33.1 39.8,33.6 v41,34.8 | v41.8,32.8 40,32.8 39.8,33 | v9.9,3 10.7,3.8 11.9,3.8 12.6,4.5 12.6,6.5 v14.6,8.5 17.1,11 v17.1,11.5 18.8,9.8 v18.8,8.2 18.9,8.1 | 18.9,8.1 20,7 v22.2,7 | v49.2,32.9 49.2,31.7 47.8,30.3 44.5,30.3 | v47.8,5.7 47.8,4.1 v45.5,1.8 32.6,1.8 v32.2,2.2 | v23,19.6 v20.1,19.6 | v39.9,23.5 41.1,23.5 v44.7,19.9 | v22.3,24.8 23.9,24.8 24.7,25.6 24.7,28.2 | v19.5,1.6 19.5,4.6 18.8,5.3 18.8,8 18.9,8.1
  pour Bottom (rank 6): -2.4,48.3 68.2,48.3 68.2,-2.8 -2.4,-2.8
  pour Top (rank 6): -1.2,47.2 66.8,47.2 66.8,-1.6 -1.2,-1.6
MISO  (via drill 0.41)
  Top 0.203: v25.6,19.4 26.5,20.3 IC2.28
  Top 0.254: v12.3,16.3 11.5,15.5 11.5,14.28 10.27,13.05 SPI.7
  Bottom 0.254: v25.6,19.4 24.6,19.4 23.8,18.6 14.2,18.6 12.3,16.7 v12.3,16.3
MOSI  (via drill 0.41)
  Top 0.203: IC2.25 28,21.8 27.4,22.4 v27.4,23.5
  Top 0.254: SPI.6 6.65,15.05 v6.4,15.3 | 28.4,21.8 IC2.25
  Bottom 0.254: v6.4,15.3 5.1,16.6 5.1,19.5 9.2,23.6 27.3,23.6 v27.4,23.5
N$1
  Top 0.254: R13.1 30.61,31.36
  Top 0.406: R13.1 32.04,31.32 TR9.1
N$2
  Top 0.406: R10.1 16.84,27.77 TR6.1
N$3
  Top 0.406: R1.1 18,24.57 TR3.1
N$5
  Top 0.406: R11.1 16.82,29.98 TR7.1
N$6
  Top 0.254: LT1.5 4.89,33.51 8.2,30.2 10.2,30.2 12.1,28.3 12.1,27.2 13.41,25.89 R1.2
N$7
  Top 0.254: C6.2 16.36,19.46 IC1.4
N$8
  Top 0.254: TR8.1
  Top 0.406: R12.1 TR8.1
N$9
  Top 0.254: LT1.4 6.9,35.15 6.9,33.4 8.8,31.5 11.2,31.5 13.1,29.6 13.1,28.4 13.84,27.66 14.38,27.66 R10.2
N$10
  Top 0.203: 38.9,18.8 IC2.6
  Top 0.254: L6.1 41.43,21.53 C21.1 40,19.9 38.9,18.8
N$11
  Top 0.254: LT1.3 8.89,33.21 9.5,32.6 12.4,32.6 14.67,30.33 R11.2
N$12
  Top 0.254: 28.57,35.54 LT2.5 28.55,35.35 27.9,34.7 27.52,34.7 R12.2
N$13
  Top 0.406: LT2.4 31.02,33.77 R13.2
N$14
  Top 0.254: 32.99,35.56 LT2.3 | R14.2 33.96,33.5
  Top 0.406: R14.2 33.41,33.29 32.99,33.71 32.99,35.56
N$15
  Top 0.254: 35.91,31.29 TR10.1
  Top 0.406: R14.1 35.91,31.29
N$16
  Top 0.254: TR12.1 46.59,28.5 48.7,28.5 50.67,30.47 R17.1
N$17
  Top 0.254: TR11.1 50.49,32.5 R16.1
N$18
  Top 0.61: LTS1.2 14.29,13.73 14.67,13.36 14.67,11.47 13.77,10.57 10.63,10.57 R22.1
N$19
  Top 0.61: LTS2.2 12.7,5.56 R23.1
N$20
  Top 0.254: LT3.5 53.35,33.01 R16.2
N$21
  Top 0.254: LT3.4 55.35,31.15 54.4,30.2 53.08,30.2 R17.2
N$22
  Top 0.254: LT3.3 57.35,30.05 55.8,28.5 52.88,28.5 R18.2
N$23
  Top 0.254: LT4.5 58.37,22.27
  Top 0.813: R19.2 56.49,22.45 LT4.5
N$24
  Top 0.254: 56.35,20.45 R20.2
  Top 0.813: R20.2 58.52,20.42 LT4.4
N$25
  Top 0.813: R21.2 LT4.3
N$26
  Top 0.254: TR13.1 50.81,27.22 R18.1
N$27
  Top 0.254: R20.1 TR15.1
N$28
  Top 0.254: TR14.1 53.26,23.32 R19.1
N$31
  Top 0.254: TR16.1 53.54,18.45 R21.1
N$32
  Top 0.203: 14.44,22.1 IC1.1
  Top 0.254: IC1.3 15.04,20.14 15.3,20.4 15.3,21.7 14.9,22.1 14.44,22.1 14.04,22.1
  Top 0.406: D1.K 13.34,22.36 C7.2 13.02,22.04 IC1.1
N$33
  Top 0.254: TR1.1 17.85,15.64 LTS1.1
N$34
  Top 0.254: TR2.1 19.64,11.74 16.84,8.95 LTS2.1
PA00_XIN32
  Top 0.203: IC2.1 38,16.3 38.6,15.7 Y4.P$2
  Top 0.254: 38.3,14.75 Y4.P$2 37.92,13.77 C23.2
PA01_XOUT32
  Top 0.203: IC2.2 41,16.8
  Top 0.254: 41,16.8 41.7,16.1 Y4.P$1 43.02,13.13 C24.2
PA02_AIN0
  Top 0.203: IC2.3 42.1,17.3
  Top 0.254: CN2.1 47.63,2.47 45,5.1 45,14.4 42.1,17.3
PA08_TCC0-W0
  Top 0.254: 35.8,23.36 IC2.13
PA09_TCC0-W1
  Top 0.203: 36.2,22.3 35.7,22.3 35.27,22.73 IC2.14
  Top 0.254: TR13.3 45.79,25.2 39.1,25.2 36.2,22.3
PA10_TCC0-W2
  Top 0.203: IC2.15 34.77,24.37 35.04,24.64 35.54,24.64
  Top 0.254: 35.54,24.64 37.29,24.64 41.34,28.69 TR12.3
PA11_TCC0-W3
  Top 0.203: IC2.16 34.27,24.77 34.8,25.3 35.4,25.3
  Top 0.254: 35.4,25.3 36.7,25.3 40.8,29.4 40.8,30.5 41.79,31.49 TR11.3
PA14_TCC0-W4
  Top 0.203: IC2.23 30.77,24.23 29.3,25.7 28.9,25.7
  Top 0.254: TR6.3 24.02,25.7 28.9,25.7
PA15_TCC0-W5
  Top 0.203: IC2.24 29.77,23.32 28.2,24.9 27.7,24.9
  Top 0.254: 27.7,24.9 26.6,24.9 25.31,23.61 TR3.3
PA20_TCC0-W6
  Top 0.203: 28.73,19.79 27.49,19.79 26,18.3
  Top 0.254: 28.73,19.79 IC2.29 | TR1.3 23.02,18.3 26,18.3
PA30_SWCLK
  Top 0.203: IC2.45 34.27,11.73
  Top 0.254: R3.2 34.27,11.73
PA31_SWDIO
  Top 0.203: IC2.46 34.77,13.7 35.47,13
  Top 0.254: R5.2 35.47,13 35.47,13.03
PB10_S4_SPI_MOSI
  Top 0.203: IC2.19 32.77,26.77
  Top 0.254: 32.77,26.77 34.51,28.51 34.51,28.82 TR10.3
PB11_S4_SPI_SCK
  Top 0.203: IC2.20 32.27,26.03
  Top 0.254: TR9.3 31.11,27.19 32.27,26.03
PB12_S4_SPI_MISO
  Top 0.203: IC2.21 31.77,25.13
  Top 0.254: TR8.3 27.01,28.29 27.7,27.6 29.3,27.6 31.7,25.2 31.77,25.13
RESET  (via drill 0.41)
  Top 0.254: R2.1 R35.2 25.79,10.79 24.48,9.48 | SW1.C 24.18,9.18 24.48,9.48 | 24.48,9.48 30.98,9.48 30.68,9.18 | 30.68,9.18 28.7,7.2 28.7,4.49 D2.A 26.81,2.6 v29.4,2.6 | 30.68,9.18 SW1.D | CN1.10 35.57,3.63 v35.2,4
  Bottom 0.254: v35.2,4 30.8,4 v29.4,2.6
SCK  (via drill 0.41)
  Top 0.203: IC2.26 27,21.3 25.9,22.4 v25.1,22.4
  Top 0.254: SPI.5 6.95,17.05 v6.6,17.4
  Bottom 0.203: v25.1,22.4 12.2,22.4 12,22.6 10.2,22.6
  Bottom 0.254: v6.6,17.4 6.6,19 10.2,22.6
SCL  (via drill 0.41)
  Top 0.203: IC2.32 30.5,18.3 v30.7,18.1
  Top 0.254: v46.2,13.5 46.38,13.5 | 46.38,13.5 R8.1 | P1.3 52.83,9.57 51.1,11.3 48.5,11.3 46.38,13.42 46.38,13.5
  Bottom 0.254: v30.7,18.1 33.5,18.1 34.9,19.5 40.5,19.5 46.2,13.8 v46.2,13.5
SDA  (via drill 0.41)
  Top 0.203: IC2.31 29.9,18.8 32,20.9 33.6,20.9 v34.6,21.9
  Top 0.254: R9.1 52.54,14.56 v53.4,13.7 54.08,13.03 P1.4
  Bottom 0.254: v34.6,21.9 40.3,21.9 48.5,13.7 v53.4,13.7
SS  (via drill 0.41)
  Top 0.203: IC2.27 v24.6,20.8
  Top 0.254: SPI.3 11.15,21.05 v11.5,21.4
  Bottom 0.254: v24.6,20.8 12.1,20.8 v11.5,21.4
SWCLK
  Top 0.254: CN1.4 40.28,2.08 39.9,1.7 34.4,1.7 34.11,1.99 R3.1
SWDIO
  Top 0.254: R5.1 35.67,9.77 42.33,9.77 43.9,8.2 43.9,2.5 43.3,1.9 41.9,1.9 41.43,2.37 CN1.2
TARGET_RESET
  Top 0.254: R2.2 28.39,13.97 C8.1 28.56,13.8 30.2,13.8 30.4,13.6 31.3,13.6 31.77,14.07 IC2.40
VDDCORE
  Top 0.203: IC2.43 33.27,14.07 31.8,12.6 C19.1

### Text on the board
tPlace: #408 | Rev0.0.0 | append board
bPlace: S/N | #408